# Altium schematic sheet Sheet_ESP32.SchDoc
size A4
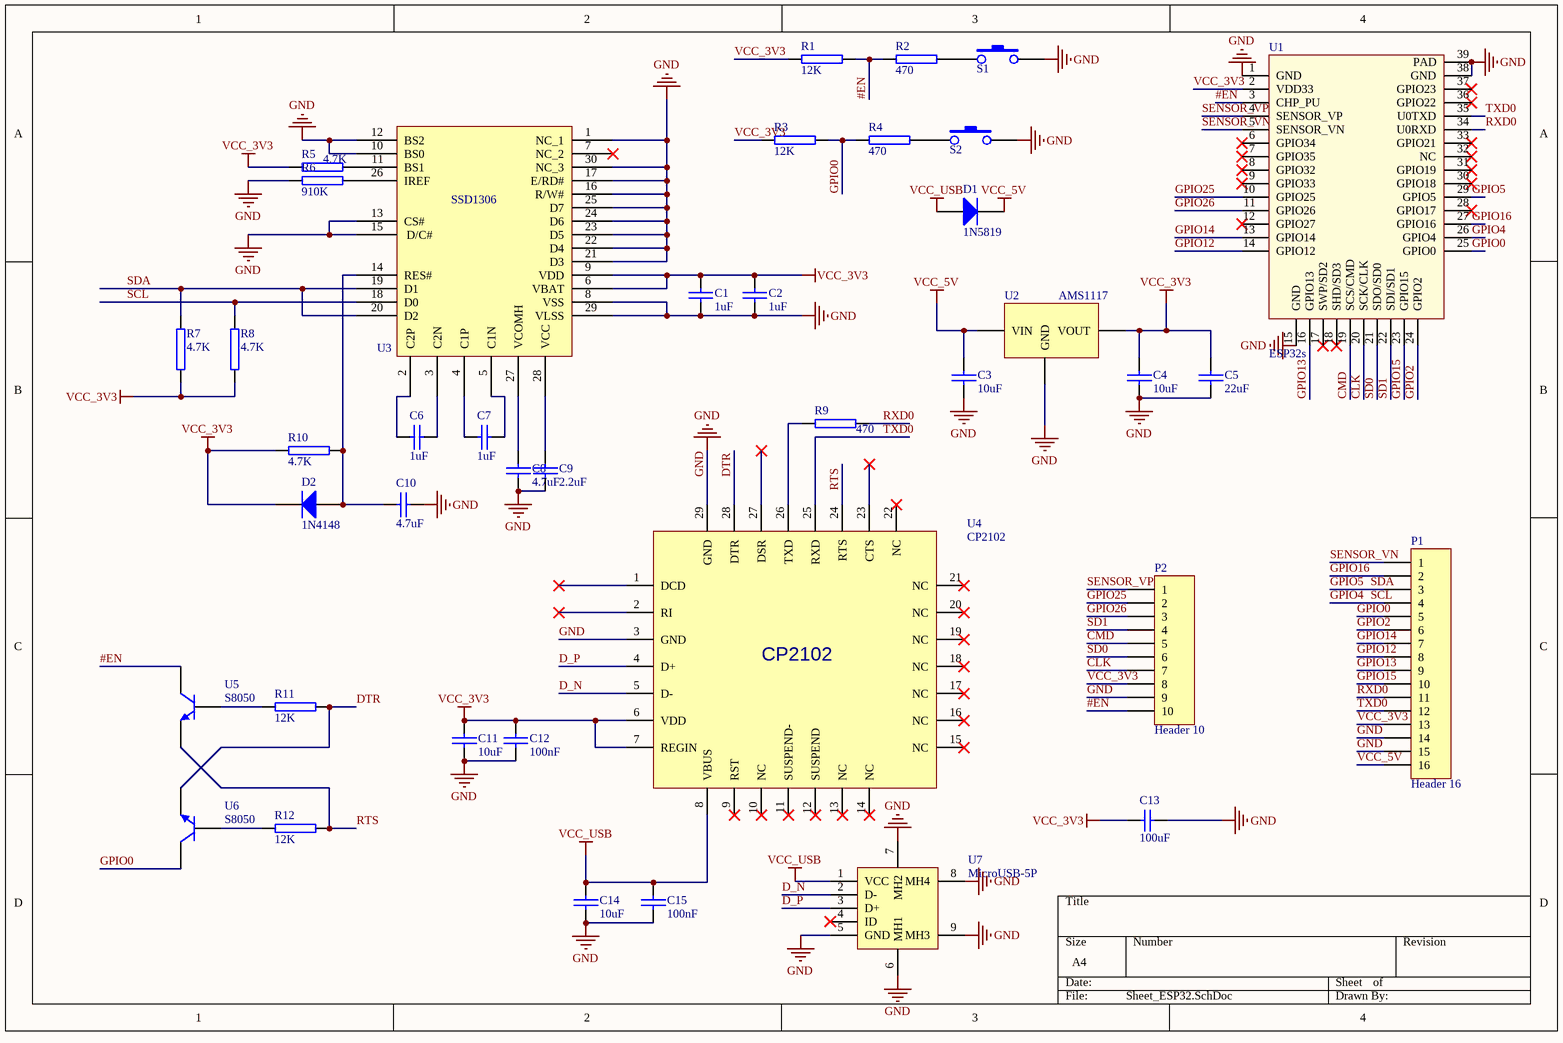
[diagram p0: Sheet_ESP32.SchDoc]

## Parts
C1  1uF  [C0603]
C2  1uF  [C0603]
C3  10uF  [C0603]
C4  10uF  [C0603]
C5  22uF  [C0603]
C6  1uF  [C0603]
C7  1uF  [C0603]
C8  4.7uF  [C0603]
C9  2.2uF  [C0603]
C10  4.7uF  [C0603]
C11  10uF  [C0603]
C12  100nF  [C0603]
C13  100uF  [C3528]
C14  10uF  [C0603]
C15  100nF  [C0603]
D1  1N5819  [1n4148]
D2  1N4148  [1n4148]
P1  Header 16  [HDR1X16]
P2  Header 10  [HDR1X10]
R1  12K  [R0603]
R2  470  [R0603]
R3  12K  [R0603]
R4  470  [R0603]
R5  4.7K  [R0603]
R6  910K  [R0603]
R7  4.7K  [R0603]
R8  4.7K  [R0603]
R9  470  [R0603]
R10  4.7K  [R0603]
R11  12K  [R0603]
R12  12K  [R0603]
S1  贴片按钮  [switch]  (value not drawn)
S2  贴片按钮  [switch]  (value not drawn)
U1  ESP32s  [ESP32s]
U2  AMS1117  [AMS1117]
U3  SSD1306  [SSD1306]  (value not drawn)
U4  CP2102  [cp2102]
U5  S8050  [s8050]
U6  S8050  [s8050]
U7  MicroUSB-5P  [MICROUSB_5S]

## Nets
GND: C1.2 C2.2 C3.2 C4.2 C5.2 C8.2 C9.2 C10.2 C11.2 C12.2 C13.2 C14.2 C15.2 P1.14 P1.15 P2.9 R6.1 S1.2 S2.2 U1.1(GND) U1.15(GND) U1.38(GND) U1.39(PAD) U2.1(GND) U3.1(NC_1) U3.8(VSS) U3.10(BS0) U3.12(BS2) U3.13(CS#) U3.15(D/C#) U3.16(R/W#) U3.17(E/RD#) U3.21(D3) U3.22(D4) U3.23(D5) U3.24(D6) U3.25(D7) U3.29(VLSS) U3.30(NC_3) U4.3(GND) U4.29(GND) U7.5(GND) U7.6(MH1) U7.7(MH2) U7.8(MH4) U7.9(MH3)
VCC_3V3: C1.1 C2.1 C4.1 C5.1 C11.1 C12.1 C13.1 D2.2(K) P1.13 P2.8 R1.2 R3.2 R5.1 R7.1 R8.1 R10.1 U1.2(VDD33) U2.2(VOUT) U3.6(VBAT) U3.9(VDD) U4.6(VDD) U4.7(REGIN)
VCC_5V: C3.1 D1.2(K) P1.16 U2.3(VIN)
VCC_USB: C14.1 C15.1 D1.1(A) U4.8(VBUS) U7.1(VCC)
#EN: P2.10 R1.1 R2.2 U1.3(CHP_PU) U5.3(C)
CLK: P2.7 U1.20(SCK/CLK)
CMD: P2.5 U1.19(SCS/CMD)
D_N: U4.5(D-) U7.2(D-)
D_P: U4.4(D+) U7.3(D+)
DTR: R11.2 U4.28(DTR) U6.2(E)
GPIO0: P1.5 R3.1 R4.2 U1.25(GPIO0) U6.3(C)
GPIO2: P1.6 U1.24(GPIO2)
GPIO4: P1.4 R8.2 U1.26(GPIO4) U3.18(D0)  [also labelled SCL]
GPIO5: P1.3 R7.2 U1.29(GPIO5) U3.19(D1) U3.20(D2)  [also labelled SDA]
GPIO12: P1.8 U1.14(GPIO12)
GPIO13: P1.9 U1.16(GPIO13)
GPIO14: P1.7 U1.13(GPIO14)
GPIO15: P1.10 U1.23(GPIO15)
GPIO16: P1.2 U1.27(GPIO16)
GPIO25: P2.2 U1.10(GPIO25)
GPIO26: P2.3 U1.11(GPIO26)
RTS: R12.2 U4.24(RTS) U5.2(E)
RXD0: P1.11 R9.2 U1.34(U0RXD)
SD0: P2.6 U1.21(SDO/SD0)
SD1: P2.4 U1.22(SDI/SD1)
SENSOR_VN: P1.1 U1.5(SENSOR_VN)
SENSOR_VP: P2.1 U1.4(SENSOR_VP)
TXD0: P1.12 U1.35(U0TXD) U4.25(RXD)
NetC6_1: C6.1 U3.2(C2P)
NetC6_2: C6.2 U3.3(C2N)
NetC7_1: C7.1 U3.5(C1N)
NetC7_2: C7.2 U3.4(C1P)
NetC8_1: C8.1 U3.27(VCOMH)
NetC9_1: C9.1 U3.28(VCC)
NetC10_1: C10.1 D2.1(A) R10.2 U3.14(RES#)
NetR2_1: R2.1 S1.1
NetR4_1: R4.1 S2.1
NetR5_2: R5.2 U3.11(BS1)
NetR6_2: R6.2 U3.26(IREF)
NetR9_1: R9.1 U4.26(TXD)
NetR11_1: R11.1 U5.1(B)
NetR12_1: R12.1 U6.1(B)

Not connected (* = marked no-connect by the designer): U1 6(GPIO34)* 7(GPIO35)* 8(GPIO32)* 9(GPIO33)* 12(GPIO27)* 17(SWP/SD2)* 18(SHD/SD3)* 28(GPIO17)* 30(GPIO18)* 31(GPIO19)* 32(NC)* 33(GPIO21)* 36(GPIO22)* 37(GPIO23)*; U3 7(NC_2)*; U4 1(DCD)* 2(RI)* 9(RST)* 10(NC)* 11(SUSPEND-)* 12(SUSPEND)* 13(NC)* 14(NC)* 15(NC)* 16(NC)* 17(NC)* 18(NC)* 19(NC)* 20(NC)* 21(NC)* 22(NC)* 23(CTS)* 27(DSR)*; U7 4(ID)*

## Library data of the parts
C1-C12 C14 C15 = C0603: 贴片电容
C13 = Cap Semi: Capacitor 3.5x2.8mm; Published: 8-Jun-2000; LatestRevisionDate: 29-May-2009; LatestRevisionNote: IPC-7351 Footprint Added.; PackageReference: C1206; Publisher: Altium Limited; PackageDescription: Chip Capacitor; Value: 100uF
D1 D2 = 1N4148: 二极管
P1 = Header 16: Header, 16-Pin; LatestRevisionDate: 17-Jul-2002; LatestRevisionNote: Re-released for DXP Platform.; Publisher: Altium Limited
P2 = Header 10: Header, 10-Pin; LatestRevisionDate: 17-Jul-2002; LatestRevisionNote: Re-released for DXP Platform.; Publisher: Altium Limited
R1-R12 = R0603: 贴片电阻
S1 S2 = Switch: 3*4*2mm开关
U1 = ESP32: WIFI&Bluetooth
U2 = AMS1117: 3.3V稳压芯片
U3 = SSD1306: 0.96寸OLED
U4 = CP2102: USB转串口芯片
U5 U6 = S8050: 三极管
U7 = MicroUSB_5S: Micro USB插脚